# Altium schematic sheet ELEKID_POWER.SchDoc
size A4
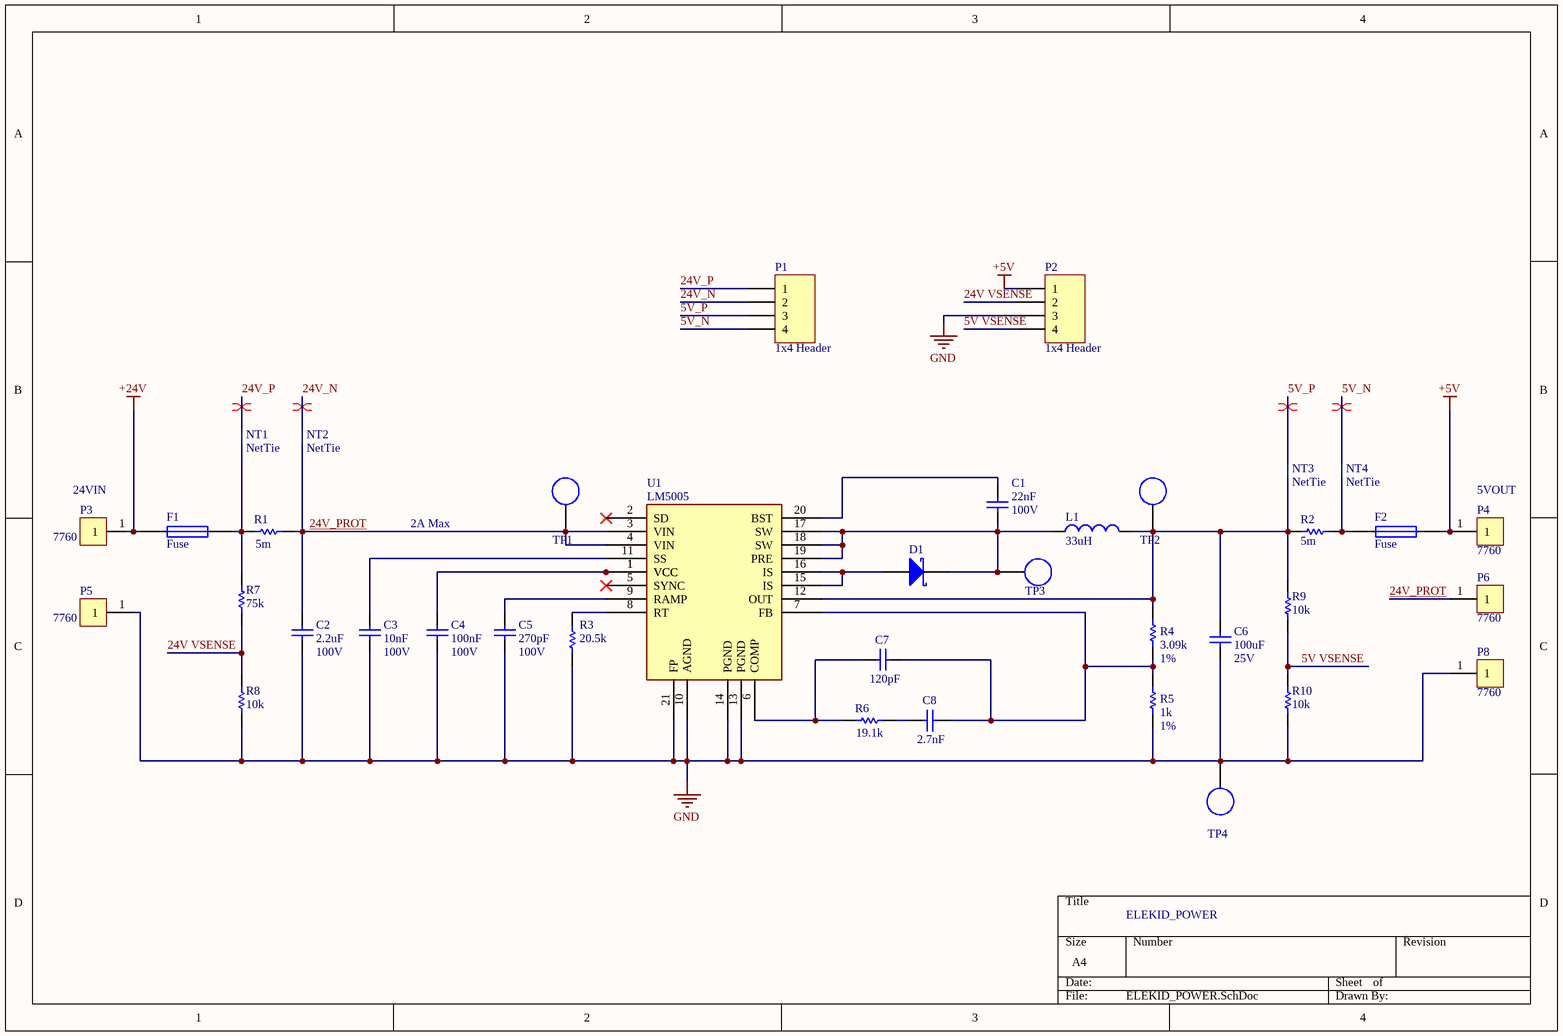
[diagram p0: ELEKID_POWER.SchDoc]

## Parts
C1  value 22nF  [0805 - Capacitor]
C2  value 2.2uF  [0805 - Capacitor]
C3  value 10nF  [0805 - Capacitor]
C4  value 100nF  [0805 - Capacitor]
C5  value 270pF  [0805 - Capacitor]
C6  value 100uF  [1206 - Capacitor]  (hidden comment: Capacitor - Nonpolarized)
C7  value 120pF  [0805 - Capacitor]
C8  value 2.7nF  [0805 - Capacitor]
D1  Diode - Schottky  [SMA - DIODE]  (value not drawn)
F1  Fuse  [3557-2]
F2  Fuse  [3557-2]
L1  value 33uH  [MSS1210 - INDUCTOR]  (hidden comment: Inductor)
NT1  NetTie  [Net Tie]  (net tie, no BOM)
NT2  NetTie  [Net Tie]  (net tie, no BOM)
NT3  NetTie  [Net Tie]  (net tie, no BOM)
NT4  NetTie  [Net Tie]  (net tie, no BOM)
P1  1x4 Header  [B4B-XH]
P2  1x4 Header  [B4B-XH]
P3  7760  [7760]
P4  7760  [7760]
P5  7760  [7760]
P6  7760  [7760]
P8  7760  [7760]
R1  value 5m  [0603 - Resistor]  (hidden comment: Resistor)
R2  value 5m  [0603 - Resistor]  (hidden comment: Resistor)
R3  value 20.5k  [0603 - Resistor]
R4  value 3.09k  [0603 - Resistor]
R5  value 1k  [0805 - Resistor]
R6  value 19.1k  [0603 - Resistor]
R7  value 75k  [0603 - Resistor]  (hidden comment: Resistor)
R8  value 10k  [0603 - Resistor]  (hidden comment: Resistor)
R9  value 10k  [0603 - Resistor]  (hidden comment: Resistor)
R10  value 10k  [0603 - Resistor]  (hidden comment: Resistor)
TP1  Test Point  [Test Point]  (value not drawn)  (no BOM)
TP2  Test Point  [Test Point]  (value not drawn)  (no BOM)
TP3  Test Point  [Test Point]  (value not drawn)  (no BOM)
TP4  Test Point  [Test Point]  (value not drawn)  (no BOM)
U1  LM5005  [LM5005]

## Nets
+5V: F2.1 P2.1 P4.1
+24V: F1.2 P3.1
GND: C2.1 C3.1 C4.1 C5.1 C6.2 P2.3 P5.1 P8.1 R3.1 R5.1 R8.2 R10.1 TP4.0 U1.10(AGND) U1.13(PGND) U1.14(PGND) U1.21(FP)
5V VSENSE: P2.4 R9.1 R10.2
5V_N: NT4.2 P1.4
5V_P: NT3.2 P1.3
24V VSENSE: P2.2 R7.1 R8.1
24V_N: NT2.2 P1.2
24V_P: NT1.2 P1.1
24V_PROT: C2.2 NT2.1 P6.1 R1.1 TP1.0 U1.3(VIN) U1.4(VIN)
NetC1_1: C1.1 D1.2(K) L1.1 TP3.0 U1.17(SW) U1.18(SW) U1.19(PRE)
NetC1_2: C1.2 U1.20(BST)
NetC3_2: C3.2 U1.11(SS)
NetC4_2: C4.2 U1.1(VCC)
NetC5_2: C5.2 U1.9(RAMP)
NetC6_1: C6.1 L1.2 NT3.1 R2.1 R4.2 R9.2 TP2.0 U1.12(OUT)
NetC7_1: C7.1 C8.1 R4.1 R5.2 U1.7(FB)
NetC7_2: C7.2 R6.2 U1.6(COMP)
NetC8_2: C8.2 R6.1
NetD1_1: D1.1(A) U1.15(IS) U1.16(IS)
NetF1_1: F1.1 NT1.1 R1.2 R7.2
NetF2_2: F2.2 NT4.1 R2.2
NetR3_2: R3.2 U1.8(RT)

Not connected (* = marked no-connect by the designer): U1 2(SD)* 5(SYNC)*

## Layout directives
differential pair: 5V_N, 5V_P, 24V_N, 24V_P

## Notes on the sheet
- (near P3) 24VIN
- (near C1) 100V
- (near P4) 5VOUT
- 2A Max
- (near C2) 100V
- (near C3) 100V
- (near C4) 100V
- (near C5) 100V
- (near R4) 1%
- (near C6) 25V
- (near R5) 1%
- ELEKID_POWER

## Library data of the parts
C1-C8 = Capacitor - Nonpolarized: Nonpolarized Capacitor; Manufacturer: *; Rating: *; Manufacturer Part Number: *
  C1: Supplier Part Number: 311-3547-1-ND; Supplier: *; Supplier 1: Digi-Key
  C2: Supplier Part Number: 311-3420-1-ND; Supplier: *; Supplier 1: Digi-Key
  C3: Supplier Part Number: 311-1136-1-ND; Supplier: *; Supplier 1: Digi-Key
  C4: Supplier Part Number: 311-1140-1-ND; Supplier: *; Supplier 1: Digi-Key
  C5: Supplier Part Number: 311-1191-1-ND; Supplier: *; Supplier 1: Digi-Key
  C6: Supplier: Digi-Key; Supplier Part Number: 445-6007-1-ND
  C7: Supplier Part Number: 311-1112-1-ND; Supplier: *; Supplier 1: Digi-Key
  C8: Supplier Part Number: 311-1130-1-ND; Supplier: *; Supplier 1: Digi-Key
D1 = Diode - Schottky: Schottky Rectifier; Rating: *; Supplier Part Number: 1655-10TQ045SCT-ND; Supplier: *; Manufacturer: *; ComponentLink1Description: Manufacturer Link; ComponentLink1URL: http://www.irf.com/; ComponentLink2Description: Datasheet; ComponentLink2URL: http://www.irf.com/product-info/datasheets/data/10tq.pdf; Value: *; Supplier 1: Digi-Key
NT1-NT4 = Net Tie
P1 P2 = 1x4 Header: 1x4 Pin Header; Supplier Part Number: 455-2249-ND
R3-R6 = Resistor: Rating: *; Manufacturer: *; Supplier: *; Supplier 1: Digi-Key
  R3: Manufacturer Part Number: *; Supplier Part Number: 311-20.5KHRCT-ND
  R4: Manufacturer Part Number: *; Supplier Part Number: 311-3.09KHRCT-ND
  R5: Manufacturer Part Number: *; Supplier Part Number: 311-1.00KHRCT-ND
  R6: Supplier Part Number: 311-19.1KHRCT-ND
U1 = LM5005: 7V to 75V 2.5A, Buck Converter; Manufacturer: Texas Instruments; Manufacturer Part Number: LM5005MHX/NOPB; Datasheet: https://www.ti.com/lit/ds/symlink/lm5005.pdf?HQS=TI-null-null-digikeymode-df-pf-null-wwe&ts=1606456124909; Supplier Part Number: LM5005MHX/NOPBCT-ND; Supplier: Digi-Key; Supplier 1: Digi-Key
F1 F2 = Fuse: Rating: *; Supplier Part Number: 36-3557-2-ND; Manufacturer: *; Manufacturer Part Number: *; Value: *
  F1: Supplier: Digikey
  F2: Supplier: *
L1 = Inductor: Rating: *; Manufacturer Part Number: *; Supplier Part Number: 994-MSS1210-333MEB; Supplier: Mouser; Manufacturer: *; Supplier 1: Mouser
P3-P6 P8 = 7760: Supplier Part Number: 36-7760-ND
  P3 P5: Supplier: Digikey
R1 R2 R7-R10 = Resistor: Rating: *; Manufacturer Part Number: *; Manufacturer: *
  R1 R2: Supplier Part Number: CSRF0603FT5L00CT-ND; Supplier: Digikey
  R7: Supplier Part Number: P75KBYCT-ND; Supplier: *; Supplier 1: Digi-Key; Supplier Part Number 1: P75KBYCT-ND
  R8: Supplier Part Number: 311-10.0KHRCT-ND; Supplier: Digikey
  R9 R10: Supplier Part Number: 311-10.0KHRCT-ND; Supplier: *